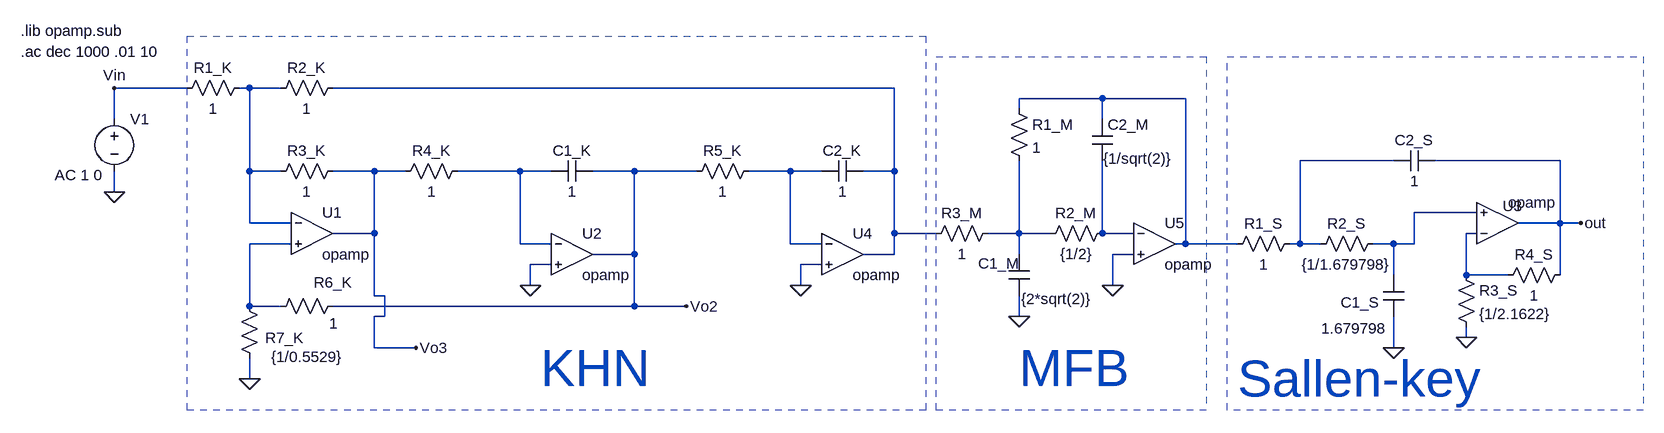
[diagram p0: schematic 26TS_2_sintesis_normalizada_ganancia.asc]
26TS_2_sintesis_normalizada_ganancia.asc, the LTspice schematic file:
Version 4.1
SHEET 1 2164 680
WIRE -80 80 -192 80
WIRE 16 80 0 80
WIRE 64 80 16 80
WIRE 1008 80 144 80
WIRE 1328 96 1200 96
WIRE 1456 96 1328 96
WIRE 1200 112 1200 96
WIRE -192 128 -192 80
WIRE 1328 128 1328 96
WIRE 1776 192 1632 192
WIRE 2032 192 1840 192
WIRE 16 208 16 80
WIRE 64 208 16 208
WIRE 208 208 144 208
WIRE 256 208 208 208
WIRE 432 208 336 208
WIRE 480 208 432 208
WIRE 608 208 544 208
WIRE 704 208 608 208
WIRE 848 208 784 208
WIRE 896 208 848 208
WIRE 1008 208 1008 80
WIRE 1008 208 960 208
WIRE -192 240 -192 208
WIRE 1904 272 1808 272
WIRE 16 288 16 208
WIRE 80 288 16 288
WIRE 2032 288 2032 192
WIRE 2032 288 1968 288
WIRE 2064 288 2032 288
WIRE 208 304 208 208
WIRE 208 304 144 304
WIRE 1008 304 1008 208
WIRE 1072 304 1008 304
WIRE 1200 304 1200 192
WIRE 1200 304 1152 304
WIRE 1248 304 1200 304
WIRE 1328 304 1328 192
WIRE 1376 304 1328 304
WIRE 1904 304 1888 304
WIRE 80 320 16 320
WIRE 432 320 432 208
WIRE 480 320 432 320
WIRE 848 320 848 208
WIRE 896 320 848 320
WIRE 1456 320 1456 96
WIRE 1456 320 1440 320
WIRE 1536 320 1456 320
WIRE 1632 320 1632 192
WIRE 1632 320 1616 320
WIRE 1664 320 1632 320
WIRE 1776 320 1744 320
WIRE 1808 320 1808 272
WIRE 1808 320 1776 320
WIRE 608 336 608 208
WIRE 608 336 544 336
WIRE 1008 336 1008 304
WIRE 1008 336 960 336
WIRE 1200 336 1200 304
WIRE 1376 336 1344 336
WIRE 480 352 448 352
WIRE 896 352 864 352
WIRE 1776 368 1776 320
WIRE 1888 368 1888 304
WIRE 1952 368 1888 368
WIRE 2032 368 2032 288
WIRE 448 384 448 352
WIRE 864 384 864 352
WIRE 1344 384 1344 336
WIRE 208 400 208 304
WIRE 224 400 208 400
WIRE 16 416 16 320
WIRE 64 416 16 416
WIRE 608 416 608 336
WIRE 608 416 144 416
WIRE 688 416 608 416
WIRE 224 432 224 400
WIRE 224 432 208 432
WIRE 1200 432 1200 400
WIRE 1888 464 1888 448
WIRE 208 480 208 432
WIRE 272 480 208 480
WIRE 1776 480 1776 432
WIRE 16 528 16 496
FLAG -192 240 0
FLAG -192 80 Vin
FLAG 2064 288 out
FLAG 448 384 0
FLAG 864 384 0
FLAG 16 528 0
FLAG 688 416 Vo2
FLAG 272 480 Vo3
FLAG 1344 384 0
FLAG 1200 432 0
FLAG 1776 480 0
FLAG 1888 464 0
SYMBOL voltage -192 112 R0
WINDOW 123 -92 102 Left 2
WINDOW 39 0 0 Left 0
SYMATTR Value2 AC 1 0
SYMATTR InstName V1
SYMATTR Value ""
SYMBOL OpAmps\\opamp 1936 352 M180
WINDOW 0 8 90 Left 2
SYMATTR InstName U3
SYMBOL OpAmps\\opamp 112 240 R0
SYMATTR InstName U1
SYMBOL res 16 64 R90
WINDOW 0 0 56 VBottom 2
WINDOW 3 32 56 VTop 2
SYMATTR InstName R1_K
SYMATTR Value 1
SYMBOL res 160 64 R90
WINDOW 0 0 56 VBottom 2
WINDOW 3 32 56 VTop 2
SYMATTR InstName R2_K
SYMATTR Value 1
SYMBOL res 160 192 R90
WINDOW 0 0 56 VBottom 2
WINDOW 3 32 56 VTop 2
SYMATTR InstName R3_K
SYMATTR Value 1
SYMBOL res 352 192 R90
WINDOW 0 0 56 VBottom 2
WINDOW 3 32 56 VTop 2
SYMATTR InstName R4_K
SYMATTR Value 1
SYMBOL res 800 192 R90
WINDOW 0 0 56 VBottom 2
WINDOW 3 32 56 VTop 2
SYMATTR InstName R5_K
SYMATTR Value 1
SYMBOL res 160 400 R90
WINDOW 0 -5 15 VBottom 2
WINDOW 3 27 15 VTop 2
SYMATTR InstName R6_K
SYMATTR Value 1
SYMBOL res 32 512 R180
WINDOW 0 -68 47 Left 2
WINDOW 3 -128 18 Left 2
SYMATTR InstName R7_K
SYMATTR Value {1/0.5529}
SYMBOL cap 544 192 R90
WINDOW 0 0 32 VBottom 2
WINDOW 3 32 32 VTop 2
SYMATTR InstName C1_K
SYMATTR Value 1
SYMBOL cap 960 192 R90
WINDOW 0 0 32 VBottom 2
WINDOW 3 32 32 VTop 2
SYMATTR InstName C2_K
SYMATTR Value 1
SYMBOL OpAmps\\opamp 512 272 R0
SYMATTR InstName U2
SYMBOL OpAmps\\opamp 928 272 R0
SYMATTR InstName U4
SYMBOL res 1184 96 R0
SYMATTR InstName R1_M
SYMATTR Value 1
SYMBOL res 1344 288 R90
WINDOW 0 0 56 VBottom 2
WINDOW 3 32 56 VTop 2
SYMATTR InstName R2_M
SYMATTR Value {1/2}
SYMBOL res 1168 288 R90
WINDOW 0 0 56 VBottom 2
WINDOW 3 32 56 VTop 2
SYMATTR InstName R3_M
SYMATTR Value 1
SYMBOL OpAmps\\opamp 1408 256 R0
SYMATTR InstName U5
SYMBOL cap 1184 336 R0
WINDOW 0 -47 14 Left 2
WINDOW 3 19 69 Left 2
SYMATTR InstName C1_M
SYMATTR Value {2*sqrt(2)}
SYMBOL cap 1312 128 R0
WINDOW 3 17 61 Left 2
SYMATTR InstName C2_M
SYMATTR Value {1/sqrt(2)}
SYMBOL res 1632 304 R90
WINDOW 0 0 56 VBottom 2
WINDOW 3 32 56 VTop 2
SYMATTR InstName R1_S
SYMATTR Value 1
SYMBOL res 1760 304 R90
WINDOW 0 0 56 VBottom 2
WINDOW 3 32 56 VTop 2
SYMATTR InstName R2_S
SYMATTR Value {1/1.679798}
SYMBOL res 1936 384 R270
WINDOW 0 32 56 VTop 2
WINDOW 3 0 56 VBottom 2
SYMATTR InstName R4_S
SYMATTR Value 1
SYMBOL cap 1760 368 R0
WINDOW 0 -65 42 Left 2
WINDOW 3 -95 82 Left 2
SYMATTR InstName C1_S
SYMATTR Value 1.679798
SYMBOL cap 1840 176 R90
WINDOW 0 0 32 VBottom 2
WINDOW 3 32 32 VTop 2
SYMATTR InstName C2_S
SYMATTR Value 1
SYMBOL res 1872 352 R0
SYMATTR InstName R3_S
SYMATTR Value {1/2.1622}
TEXT -336 24 Left 2 !.ac dec 1000 .01 10
TEXT -336 -8 Left 2 !.lib opamp.sub
TEXT 464 512 Left 6 ;KHN
TEXT 1200 512 Left 6 ;MFB
TEXT 1536 528 Left 6 ;Sallen-key
RECTANGLE Normal 1056 576 -80 0 2
RECTANGLE Normal 1488 576 1072 32 2
RECTANGLE Normal 2160 576 1520 32 2

The netlist it stands for:
* 26TS_2_sintesis_normalizada_ganancia.asc
V1 Vin 0 AC 1 0
X§U3 N010 N007 out opamp Aol=100K GBW=10Meg  ; pins invin noninvin out
X§U1 N001 N011 Vo3 opamp Aol=100K GBW=10Meg  ; pins invin noninvin out
R1_K N001 Vin 1
R2_K N002 N001 1
R3_K Vo3 N001 1
R4_K N005 Vo3 1
R5_K N006 Vo2 1
R6_K Vo2 N011 1
R7_K 0 N011 {1/0.5529}
C1_K Vo2 N005 1
C2_K N002 N006 1
X§U2 N005 0 Vo2 opamp Aol=100K GBW=10Meg  ; pins invin noninvin out
X§U4 N006 0 N002 opamp Aol=100K GBW=10Meg  ; pins invin noninvin out
R1_M N003 N008 1
R2_M N009 N008 {1/2}
R3_M N008 N002 1
X§U5 N009 0 N003 opamp Aol=100K GBW=10Meg  ; pins invin noninvin out
C1_M N008 0 {2*sqrt(2)}
C2_M N003 N009 {1/sqrt(2)}
R1_S N004 N003 1
R2_S N007 N004 {1/1.679798}
R4_S N010 out 1
C1_S N007 0 1.679798
C2_S out N004 1
R3_S N010 0 {1/2.1622}
.ac dec 1000 .01 10
.lib opamp.sub
* KHN
* MFB
* Sallen-key
.backanno
.end

* Results of the author's LTspice run, read from the files saved beside the schematic
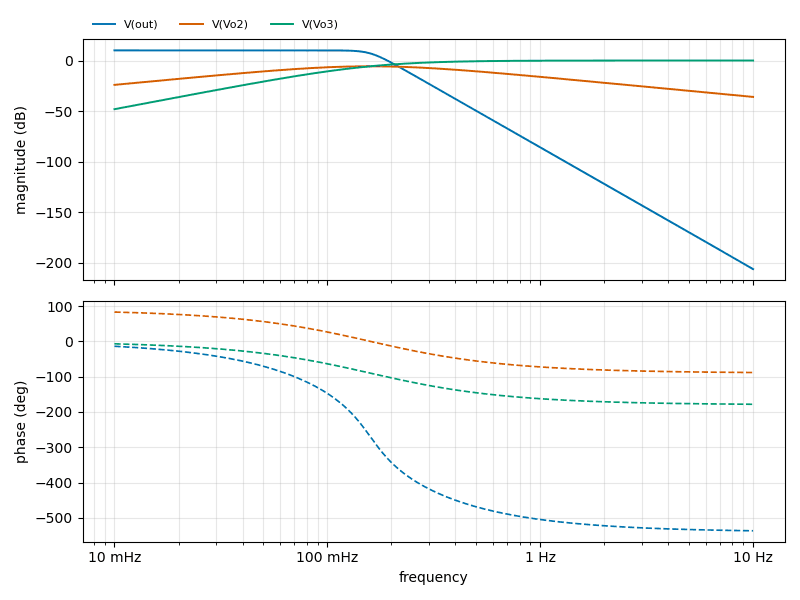
[diagram p1: AC Analysis of 26TS_2_sintesis_normalizada_ganancia.asc, plotted from the saved traces]
* AC Analysis, 1 run:
*   V(out): 10.00 dB at 10 mHz, -206.13 dB at 10 Hz, peak 10.00 dB at 10 mHz, 3 dB below the peak at 159.1 mHz
*   V(Vo2): -24.07 dB at 10 mHz, -35.97 dB at 10 Hz, peak -5.72 dB at 159.2 mHz, 3 dB below the peak at 67.54 mHz and 375 mHz
*   V(Vo3): -48.10 dB at 10 mHz, -0.00 dB at 10 Hz, peak -0.00 dB at 10 Hz, 3 dB below the peak at 235.4 mHz